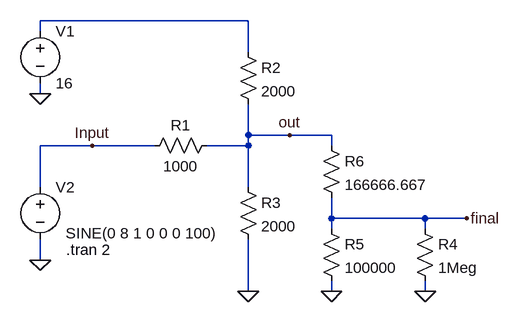
[diagram p0: schematic bipolar_to_unipolar.asc]
bipolar_to_unipolar.asc, the LTspice schematic file:
Version 4
SHEET 1 1028 680
WIRE 192 -128 -128 -128
WIRE -128 -112 -128 -128
WIRE 192 -80 192 -128
WIRE -128 -16 -128 -32
WIRE 192 48 192 0
WIRE 256 48 192 48
WIRE 320 48 256 48
WIRE -48 64 -128 64
WIRE 48 64 -48 64
WIRE 192 64 192 48
WIRE 192 64 128 64
WIRE 320 64 320 48
WIRE -128 128 -128 64
WIRE 192 128 192 64
WIRE 320 176 320 144
WIRE 464 176 320 176
WIRE 528 176 464 176
WIRE 320 192 320 176
WIRE 464 192 464 176
WIRE -128 240 -128 208
WIRE 192 288 192 208
WIRE 320 288 320 272
WIRE 464 288 464 272
FLAG -128 -16 0
FLAG 192 288 0
FLAG 464 288 0
FLAG -128 240 0
FLAG 256 48 out
FLAG 320 288 0
FLAG 528 176 final
FLAG -48 64 Input
SYMBOL res 144 48 R90
WINDOW 0 0 56 VBottom 2
WINDOW 3 32 56 VTop 2
SYMATTR InstName R1
SYMATTR Value 1000
SYMBOL res 176 -96 R0
SYMATTR InstName R2
SYMATTR Value 2000
SYMBOL res 176 112 R0
SYMATTR InstName R3
SYMATTR Value 2000
SYMBOL voltage -128 -128 R0
WINDOW 123 0 0 Left 2
WINDOW 39 0 0 Left 2
SYMATTR InstName V1
SYMATTR Value 16
SYMBOL res 448 176 R0
SYMATTR InstName R4
SYMATTR Value 1Meg
SYMBOL voltage -128 112 R0
WINDOW 123 0 0 Left 2
WINDOW 39 0 0 Left 2
WINDOW 3 39 87 Left 2
SYMATTR InstName V2
SYMATTR Value SINE(0 8 1 0 0 0 100)
SYMBOL res 304 176 R0
SYMATTR InstName R5
SYMATTR Value 100000
SYMBOL res 304 48 R0
SYMATTR InstName R6
SYMATTR Value 166666.667
TEXT -88 224 Left 2 !.tran 2

The netlist it stands for:
* bipolar_to_unipolar.asc
R1 out Input 1000
R2 N001 out 2000
R3 out 0 2000
V1 N001 0 16
R4 final 0 1Meg
V2 Input 0 SINE(0 8 1 0 0 0 100)
R5 final 0 100000
R6 out final 166666.667
.tran 2
.backanno
.end

* Results of the author's LTspice run, read from the files saved beside the schematic
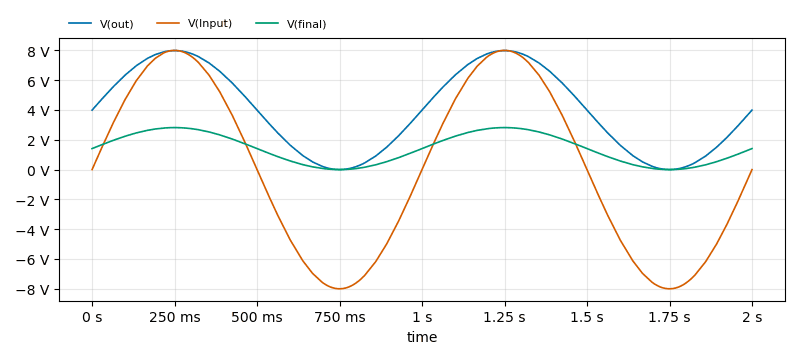
[diagram p1: Transient Analysis of bipolar_to_unipolar.asc, plotted from the saved traces]
* Transient Analysis, 1 run:
*   V(out): min 151.9 µV, max 7.984 V, average 3.992 V, rms 4.891 V, last 3.992 V
*   V(Input): min -8 V, max 8 V, average -259.7 µV, rms 5.663 V, last 0 V
*   V(final): min 53.63 µV, max 2.818 V, average 1.409 V, rms 1.726 V, last 1.409 V